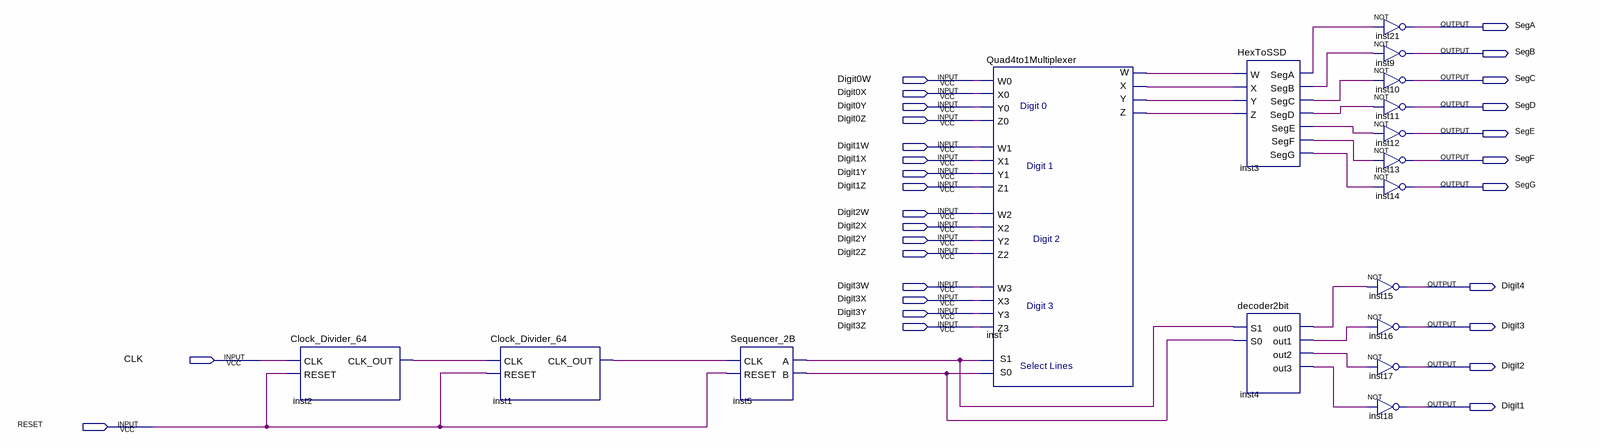
[diagram p0: schematic sheet]
// Quartus schematic Display.bdf as structural Verilog: 17 symbols, 29 pins
module Display (
  input  Digit0W,
  input  Digit0X,
  input  Digit0Y,
  input  Digit0Z,
  input  Digit1W,
  input  Digit1X,
  input  Digit1Y,
  input  Digit1Z,
  input  Digit2W,
  input  Digit2X,
  input  Digit2Y,
  input  Digit2Z,
  input  Digit3W,
  input  Digit3X,
  input  Digit3Y,
  input  Digit3Z,
  input  CLK,
  input  RESET,
  output SegA,
  output SegB,
  output SegC,
  output SegD,
  output SegE,
  output SegF,
  output SegG,
  output Digit4,
  output Digit3,
  output Digit2,
  output Digit1
);

  wire inst1_clk_out, inst2_clk_out, inst3_sega, inst3_segb, inst3_segc, inst3_segd, inst3_sege, inst3_segf,
       inst3_segg, inst4_out0, inst4_out1, inst4_out2, inst4_out3, inst5_a, inst5_b, inst_w, inst_x, inst_y,
       inst_z;

  Clock_Divider_64 inst2 (.CLK(CLK), .RESET(RESET), .CLK_OUT(inst2_clk_out));
  Clock_Divider_64 inst1 (.CLK(inst2_clk_out), .RESET(RESET), .CLK_OUT(inst1_clk_out));
  Sequencer_2B inst5 (.CLK(inst1_clk_out), .RESET(RESET), .A(inst5_a), .B(inst5_b));
  Quad4to1Multiplexer inst (
    .W0(Digit0W), .W1(Digit1W), .W2(Digit2W), .W3(Digit3W), .X0(Digit0X), .X1(Digit1X), .X2(Digit2X),
    .X3(Digit3X), .Y0(Digit0Y), .Y1(Digit1Y), .Y2(Digit2Y), .Y3(Digit3Y), .Z0(Digit0Z), .Z1(Digit1Z),
    .Z2(Digit2Z), .Z3(Digit3Z), .S1(inst5_a), .S0(inst5_b), .W(inst_w), .X(inst_x), .Y(inst_y), .Z(inst_z));
  HexToSSD inst3 (
    .W(inst_w), .X(inst_x), .Y(inst_y), .Z(inst_z), .SegA(inst3_sega), .SegB(inst3_segb), .SegC(inst3_segc),
    .SegD(inst3_segd), .SegE(inst3_sege), .SegF(inst3_segf), .SegG(inst3_segg));
  decoder2bit inst4 (
    .S1(inst5_a), .S0(inst5_b), .out0(inst4_out0), .out1(inst4_out1), .out2(inst4_out2), .out3(inst4_out3));
  not inst21 (SegA, inst3_sega);
  not inst9 (SegB, inst3_segb);
  not inst10 (SegC, inst3_segc);
  not inst11 (SegD, inst3_segd);
  not inst12 (SegE, inst3_sege);
  not inst13 (SegF, inst3_segf);
  not inst14 (SegG, inst3_segg);
  not inst15 (Digit4, inst4_out0);
  not inst16 (Digit3, inst4_out1);
  not inst17 (Digit2, inst4_out2);
  not inst18 (Digit1, inst4_out3);
endmodule
